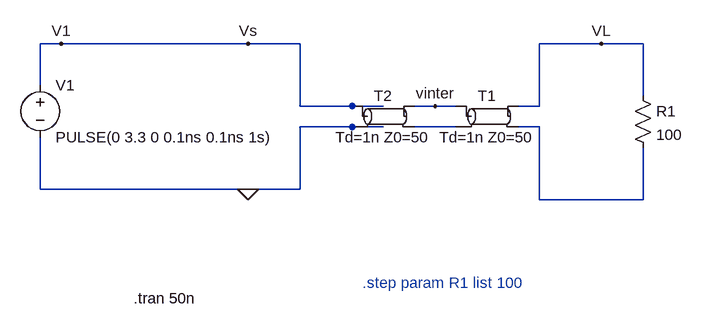
[diagram p0: schematic reflectionCoef.asc]
reflectionCoef.asc, the LTspice schematic file:
Version 4
SHEET 1 880 680
WIRE -128 48 -160 48
WIRE 160 48 -128 48
WIRE 240 48 160 48
WIRE 704 48 608 48
WIRE 768 48 704 48
WIRE -160 112 -160 48
WIRE 768 128 768 48
WIRE 240 144 240 48
WIRE 320 144 240 144
WIRE 368 144 320 144
WIRE 448 144 416 144
WIRE 480 144 448 144
WIRE 608 144 608 48
WIRE 608 144 576 144
WIRE 320 176 240 176
WIRE 368 176 320 176
WIRE 480 176 416 176
WIRE 608 176 576 176
WIRE -160 272 -160 192
WIRE 160 272 -160 272
WIRE 240 272 240 176
WIRE 240 272 160 272
WIRE 608 288 608 176
WIRE 768 288 768 208
WIRE 768 288 608 288
FLAG 160 272 0
FLAG -128 48 V1
FLAG 704 48 VL
FLAG 160 48 Vs
FLAG 448 144 vinter
SYMBOL voltage -160 96 R0
WINDOW 123 0 0 Left 0
WINDOW 39 0 0 Left 0
SYMATTR InstName V1
SYMATTR Value PULSE(0 3.3 0 0.1ns 0.1ns 1s)
SYMBOL res 752 112 R0
SYMATTR InstName R1
SYMATTR Value 100
SYMBOL tline 368 160 R0
SYMATTR InstName T2
SYMATTR Value Td=1n Z0=50
SYMBOL tline 528 160 R0
SYMATTR InstName T1
SYMATTR Value Td=1n Z0=50
TEXT 336 416 Left 2 ;.step param R1 list 100
TEXT -16 440 Left 2 !.tran 50n

The netlist it stands for:
* reflectionCoef.asc
V1 Vs 0 PULSE(0 3.3 0 0.1ns 0.1ns 1s)
R1 VL N002 100
T2 Vs 0 vinter N001 Td=1n Z0=50
T1 vinter N001 VL N002 Td=1n Z0=50
* .step param R1 list 100
.tran 50n
.backanno
.end

* Results of the author's LTspice run, read from the files saved beside the schematic
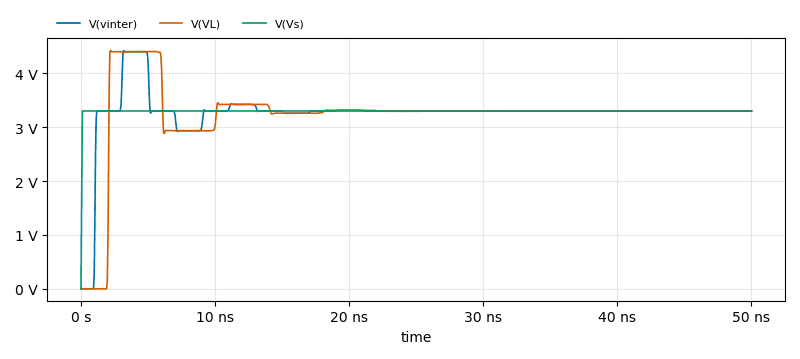
[diagram p1: Transient Analysis of reflectionCoef.asc, plotted from the saved traces]
* Transient Analysis, 1 run:
*   V(vinter): min 0 V, max 4.419 V, average 3.264 V, rms 3.305 V, last 3.3 V
*   V(VL): min 0 V, max 4.425 V, average 3.231 V, rms 3.313 V, last 3.3 V
*   V(Vs): min 0 V, max 3.3 V, average 3.297 V, rms 3.298 V, last 3.3 V